# EAGLE design F_BRIGE (EAGLE 7.2.0)
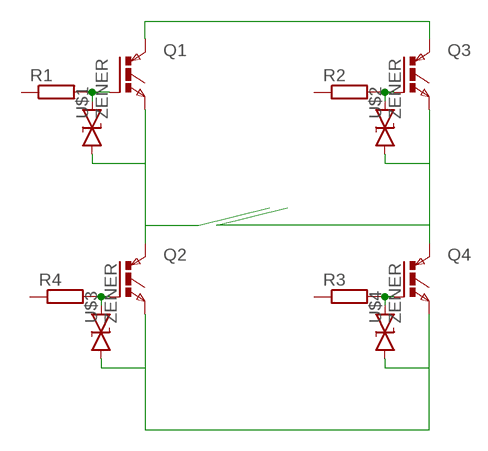
[diagram p0: schematic, sheet 1]

## Parts
Q1  IGBTTO247H  [TO247BH]
Q2  IGBTTO247H  [TO247BH]
Q3  IGBTTO247H  [TO247BH]
Q4  IGBTTO247H  [TO247BH]
R1  R-EU_0414/5V  [0414V]
R2  R-EU_0414/5V  [0414V]
R3  R-EU_0414/5V  [0414V]
R4  R-EU_0414/5V  [0414V]
U$1  ZENER  [SMA-DIODE]
U$2  ZENER  [SMA-DIODE]
U$3  ZENER  [SMA-DIODE]
U$4  ZENER  [SMA-DIODE]

## Nets
GND: Q2.S(E) Q4.S(E) U$3.A U$4.A
N$5: Q1.G R1.2 U$1.C
N$7: Q3.G R2.2 U$2.C
N$9: Q2.G R4.2 U$3.C
N$11: Q4.G R3.2 U$4.C
OUT1: Q1.S(E) Q2.D(C) U$1.A
OUT2: Q3.S(E) Q4.D(C) U$2.A
VCC: Q1.D(C) Q3.D(C)
Unconnected: R1.1 R2.1 R3.1 R4.1

## Library data of the parts
Q1-Q4 = CasaLibrary:IGBT: IGBT
R1-R4 = rcl:R-EU_: RESISTOR, European symbol
U$1-U$4 = CasaLibrary:ZENER

## Board
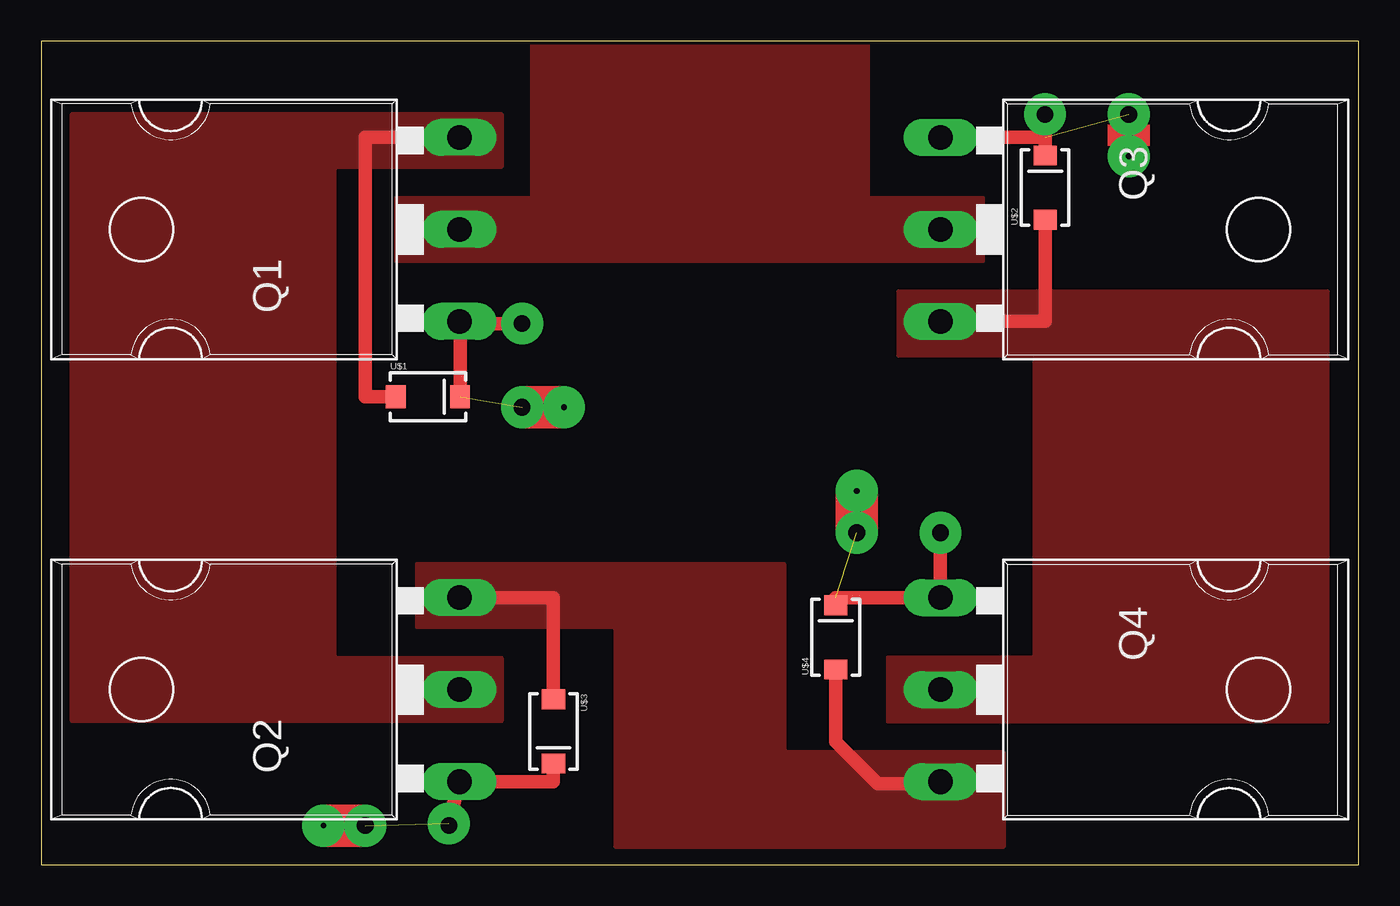
[diagram p1: board, top side]
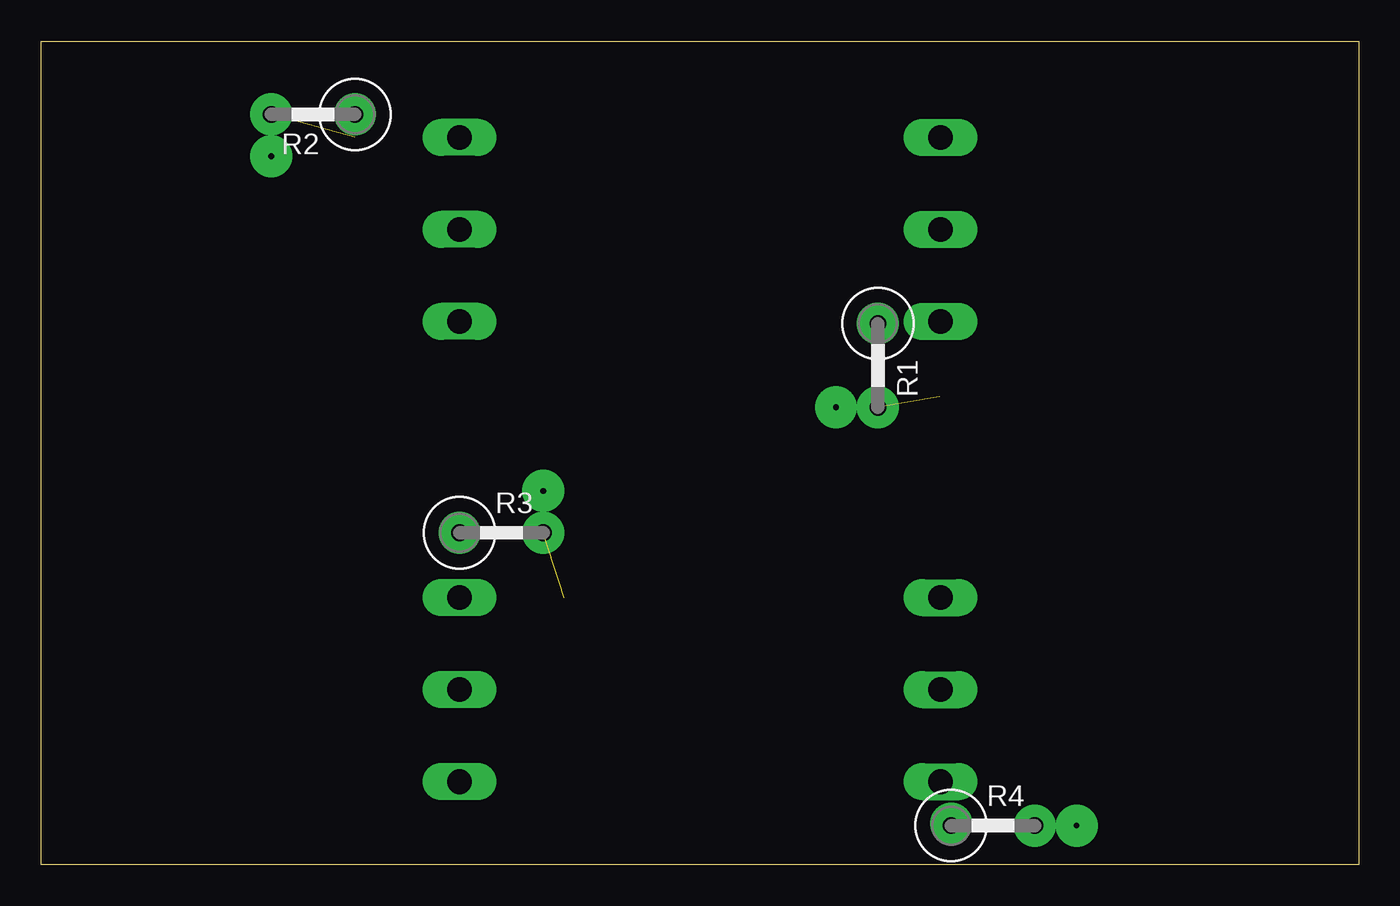
[diagram p2: board, bottom side, seen from below]

Size 80 x 50 mm. Coordinates in mm from the lower left corner, seen from the top.
Outline: 80,50 0,50 0,0 80,0 80,50
Copper layers (1*16): Top 0.035mm / dielectric 1.5mm / Bottom 0.035mm
Design rules "default": minimum track width 0.2mm, minimum drill 0.2mm, track to track 0.2mm, track to pad 0.2mm, pad to pad 0.2mm, via to via 0.2mm, smd to smd 0.2mm, copper to edge 0.2mm, drill to drill 0.2mm, minimum pad ring 10mil, minimum via ring 8mil, stop-mask expansion 4mil, vias tented up to drill 0mil, thermal gap 10mil

### Footprints (pad centres in the part's own frame; a part is rotated, then mirrored left to right if it is on the bottom)
TO247BH = drill 1.499 long: D 0,-10.16; G -5.588,-10.16; S 5.588,-10.16
0414V = drill 1.016 octagon: 1 -2.54,0; 2 2.54,0
SMA-DIODE = smd 1.2 x 1.4: A -1.95,0; C 1.95,0

### Placement (x,y rotation side)
Q1  15.23,38.57 90 top
Q2  15.23,10.63 90 top
Q3  64.76,38.57 270 top
Q4  64.76,10.63 270 top
R1  29.2,30.32 270 bottom
R2  63.49,45.55 180 bottom
R3  52.06,20.16 0 bottom
R4  22.21,2.38 0 bottom
U$1  23.48,28.41 0 top
U$2  60.95,41.11 90 top
U$3  31.1,8.09 270 top
U$4  48.25,13.81 90 top

### Tracks (layer width: path | path; a pad name or v marks a point on that pad's centre or on a via)
GND
  Top 0.813: U$4.A 48.25,7.46 50.79,4.92 54.47,4.92 Q4.S | U$3.A 31.1,16.22 Q2.S
  pour Top (no thermals): 45.08,6.82 58.41,6.82 58.41,1.1 34.91,1.1 34.91,14.44 22.85,14.44 22.85,18.25 45.08,18.25
N$1  (via drill 0.35 pad 2.54)
  other vias: 29.2,27.78
N$3  (via drill 0.35 pad 2.54)
  other vias: 19.67,2.38
N$4  (via drill 0.35 pad 2.54)
  other vias: 49.52,20.16
N$5  (1 unrouted)
  Top 0.813: Q1.G 25.43,32.98 U$1.C
N$6  (via drill 0.35 pad 2.54)
  other vias: 66.03,45.55
N$7  (via drill 0.35 pad 2.54)  (1 unrouted)
  Top 0.813: Q3.G 60.95,44.16 U$2.C
  other vias: 66.03,45.55
N$8  (via drill 0.35 pad 2.54)
  Top 0.813: 54.6,16.35 v54.6,20.16
N$9  (via drill 0.35 pad 2.54)  (1 unrouted)
  Top 0.813: U$3.C 31.1,5.04 Q2.G v24.75,2.5
  other vias: 19.67,2.38
N$10  (via drill 0.35 pad 2.54)
  Top 0.813: v60.95,45.55 60.95,44.29
N$11  (via drill 0.35 pad 2.54)  (1 unrouted)
  Top 0.813: Q4.G 48.25,16.22 U$4.C
  other vias: 49.52,20.16
N$12  (via drill 0.35 pad 2.54)
  Top 0.813: v29.2,32.86 25.39,32.86
N$13  (via drill 0.35 pad 2.54)
  other vias: 49.52,22.7
N$14  (via drill 0.35 pad 2.54)
  other vias: 31.74,27.78
N$15  (via drill 0.35 pad 2.54)
  other vias: 17.13,2.38
N$16  (via drill 0.35 pad 2.54)
  other vias: 66.03,43.02
OUT1
  Top 0.813: U$1.A 19.67,28.41 19.67,44.16 Q1.S
  pour Top (no thermals): 17.77,12.54 27.93,12.54 27.93,8.73 1.9,8.73 1.9,45.55 27.93,45.55 27.93,42.38 17.77,42.38
OUT2
  Top 0.813: U$2.A 60.95,32.98 Q3.S
  pour Top (no thermals): 60.32,12.54 51.43,12.54 51.43,8.73 78.09,8.73 78.09,34.76 52.06,34.76 52.06,30.95 60.32,30.95
VCC
  pour Top (no thermals): 57.14,36.66 21.58,36.66 21.58,40.48 29.83,40.48 29.83,50 50.16,50 50.16,40.48 57.14,40.48
(copper drawn outside any net)
  shapes: Top area x6